# Altium schematic sheet UbiWatch.SchDoc
size A; SheetNumber: 1; SheetTotal: 5
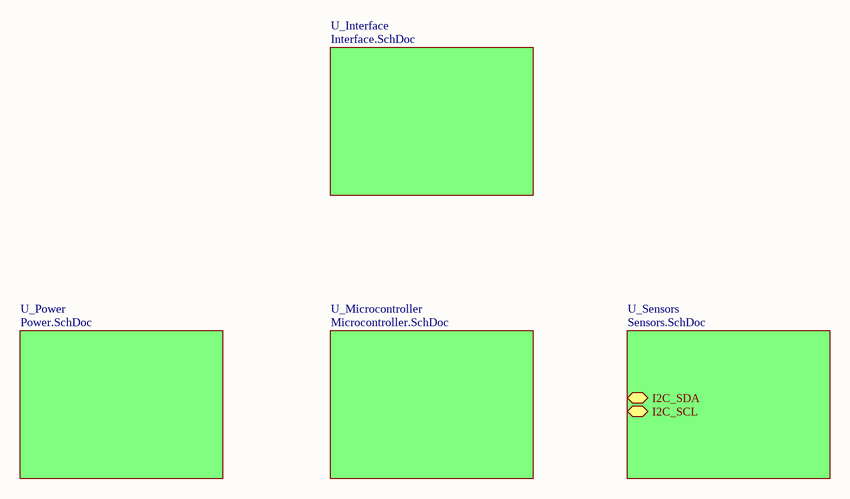
[diagram p0: UbiWatch.SchDoc]

## Sub-sheets
U_Interface = Interface.SchDoc: no entries
U_Microcontroller = Microcontroller.SchDoc: no entries
U_Power = Power.SchDoc: no entries
U_Sensors = Sensors.SchDoc: I2C_SDA (bidir), I2C_SCL (bidir)